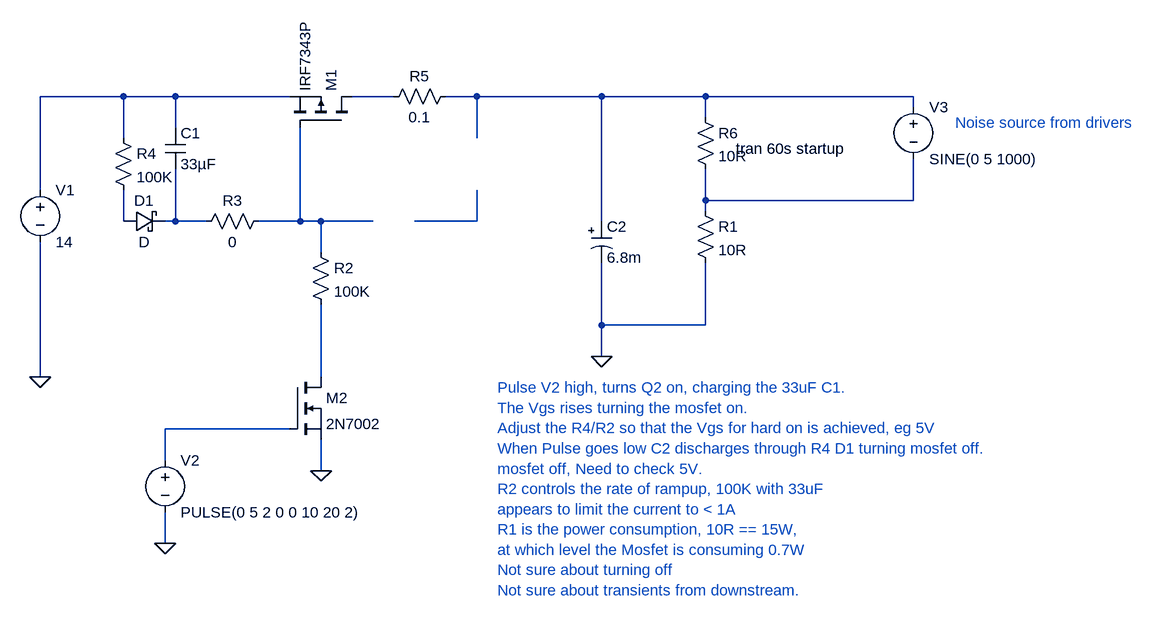
[diagram p0: schematic pchannel-softstart.asc]
pchannel-softstart.asc, the LTspice schematic file:
Version 4
SHEET 1 1636 896
WIRE 80 192 -48 192
WIRE 160 192 80 192
WIRE 336 192 160 192
WIRE 496 192 432 192
WIRE 624 192 576 192
WIRE 816 192 624 192
WIRE 976 192 816 192
WIRE 1296 192 976 192
WIRE 1296 208 1296 192
WIRE 976 224 976 192
WIRE 160 240 160 192
WIRE 80 256 80 192
WIRE 624 256 624 192
WIRE -48 336 -48 192
WIRE 976 352 976 304
WIRE 1296 352 1296 288
WIRE 1296 352 976 352
WIRE 976 368 976 352
WIRE 80 384 80 336
WIRE 160 384 160 304
WIRE 160 384 144 384
WIRE 208 384 160 384
WIRE 352 384 352 240
WIRE 352 384 288 384
WIRE 384 384 352 384
WIRE 464 384 384 384
WIRE 624 384 624 336
WIRE 624 384 528 384
WIRE 816 384 816 192
WIRE 384 432 384 384
WIRE 816 544 816 448
WIRE 976 544 976 448
WIRE 976 544 816 544
WIRE 816 592 816 544
WIRE -48 624 -48 416
WIRE 384 624 384 512
WIRE 336 704 144 704
WIRE 144 752 144 704
WIRE 384 768 384 720
WIRE 144 880 144 832
FLAG 384 768 0
FLAG -48 624 0
FLAG 816 592 0
FLAG 144 880 0
SYMBOL voltage -48 320 R0
SYMATTR InstName V1
SYMATTR Value 14
SYMATTR SpiceLine Rser=1
SYMBOL cap 144 240 R0
SYMATTR InstName C1
SYMATTR Value 33µF
SYMBOL res 368 416 R0
SYMATTR InstName R2
SYMATTR Value 100K
SYMBOL polcap 800 384 R0
WINDOW 0 24 8 Left 2
WINDOW 3 24 56 Left 2
SYMATTR InstName C2
SYMATTR Value 6.8m
SYMATTR SpiceLine Rser=3m Lser=0 mfg="   ---" pn="   ---" type="   ---"
SYMATTR Description Capacitor
SYMATTR Type cap
SYMBOL pmos 432 240 M270
SYMATTR InstName M1
SYMATTR Value IRF7343P
SYMBOL res 304 368 R90
WINDOW 0 0 56 VBottom 2
WINDOW 3 32 56 VTop 2
SYMATTR InstName R3
SYMATTR Value 0
SYMBOL res 960 352 R0
SYMATTR InstName R1
SYMATTR Value 10R
SYMBOL nmos 336 624 R0
SYMATTR InstName M2
SYMATTR Value 2N7002
SYMBOL voltage 144 736 R0
SYMATTR InstName V2
SYMATTR Value PULSE(0 5 2 0 0 10 20 2)
SYMBOL schottky 80 400 R270
WINDOW 0 32 32 VTop 2
WINDOW 3 0 32 VBottom 2
SYMATTR InstName D1
SYMBOL res 592 176 R90
WINDOW 0 0 56 VBottom 2
WINDOW 3 32 56 VTop 2
SYMATTR InstName R5
SYMATTR Value 0.1
SYMBOL res 64 240 R0
SYMATTR InstName R4
SYMATTR Value 100K
SYMBOL res 960 208 R0
SYMATTR InstName R6
SYMATTR Value 10R
SYMBOL voltage 1296 192 R0
SYMATTR InstName V3
SYMATTR Value SINE(0 5 1000)
TEXT 1016 272 Left 2 !.tran 60s startup
TEXT 656 640 Left 2 ;Pulse V2 high, turns Q2 on, charging the 33uF C1.\nThe Vgs rises turning the mosfet on.\nAdjust the R4/R2 so that the Vgs for hard on is achieved, eg 5V\nWhen Pulse goes low C2 discharges through R4 D1 turning mosfet off.\nmosfet off, Need to check 5V.\nR2 controls the rate of rampup, 100K with 33uF \nappears to limit the current to < 1A\nR1 is the power consumption, 10R == 15W, \nat which level the Mosfet is consuming 0.7W\nNot sure about turning off\nNot sure about transients from downstream.
TEXT 1360 232 Left 2 ;Noise source from drivers

The netlist it stands for:
* pchannel-softstart.asc
V1 N001 0 14 Rser=1
C1 N001 N006 33µF
R2 N007 N009 100K
C2 N003 0 6.8m Rser=3m Lser=0 mfg="   ---" pn="   ---" type="   ---"
M1 N002 N007 N001 N001 IRF7343P
R3 N007 N006 0
R1 N004 0 10R
M2 N009 N010 0 0 2N7002
V2 N010 0 PULSE(0 5 2 0 0 10 20 2)
D1 N005 N006 D
R5 N003 N002 0.1
R4 N001 N005 100K
R6 N003 N004 10R
V3 N003 N004 SINE(0 5 1000)
.model D D
.lib standard.dio
.model NMOS NMOS
.model PMOS PMOS
.lib standard.mos
.tran 60s startup
* Pulse V2 high, turns Q2 on, charging the 33uF C1.
* The Vgs rises turning the mosfet on.
* Adjust the R4/R2 so that the Vgs for hard on is achieved, eg 5V
* When Pulse goes low C2 discharges through R4 D1 turning mosfet off.
* mosfet off, Need to check 5V.
* R2 controls the rate of rampup, 100K with 33uF
* appears to limit the current to < 1A
* R1 is the power consumption, 10R == 15W,
* at which level the Mosfet is consuming 0.7W
* Not sure about turning off
* Not sure about transients from downstream.
* Noise source from drivers
.backanno
.end